# Altium schematic sheet [MP] Block diagram.SchDoc
size 254 x 208 mm
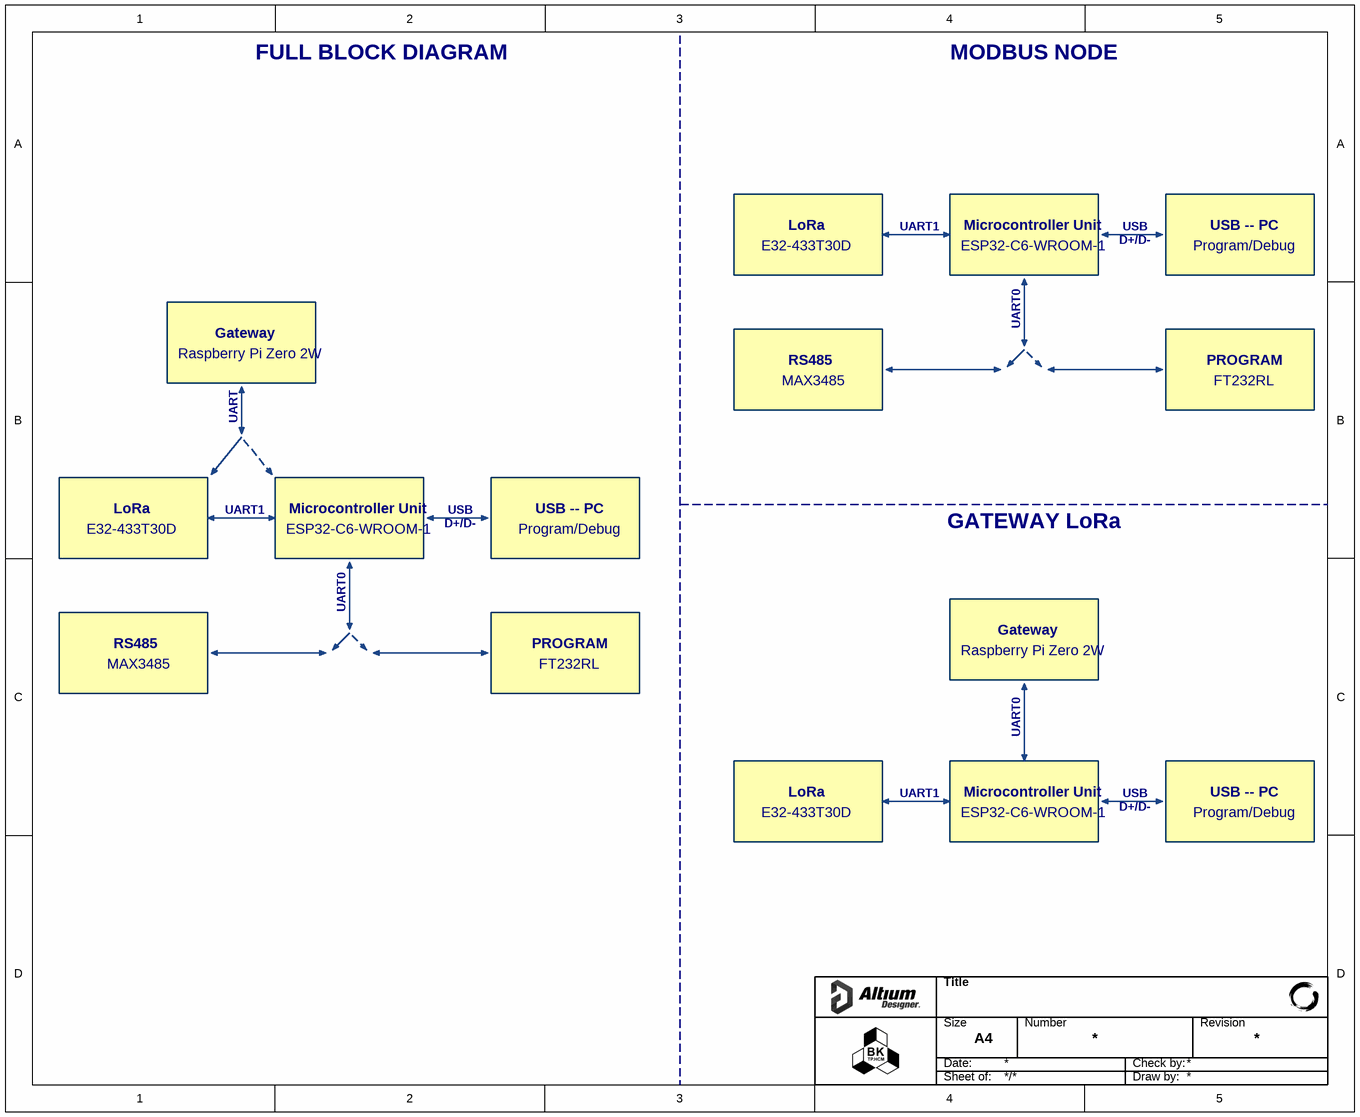
[diagram p0: [MP] Block diagram.SchDoc]

## Notes on the sheet
- FULL BLOCK DIAGRAM
- MODBUS NODE
- E32-433T30D
- LoRa
- UART1
- ESP32-C6-WROOM-1
- Microcontroller Unit
- D+/D-
- USB
- Program/Debug
- USB -- PC
- UART0
- Raspberry Pi Zero 2W
- Gateway
- MAX3485
- RS485
- PROGRAM
- FT232RL
- UART
- GATEWAY LoRa
- Title
- Size
- Date:
- A4
- Number
- Check by:
- Revision
- Sheet of:
- Draw by: